# EasyEDA Pro project 单向户外电源_明月班.epro, schematic Schematic1
Board Name: 预驱; Create Date: 2025-08-27; Page Name: P1; Project Name: 单向户外电源; Schematic Name: Schematic1; Update Date: 2025-09-22; Company: 嘉立创EDA; Page Size: A4; Version: V1.0
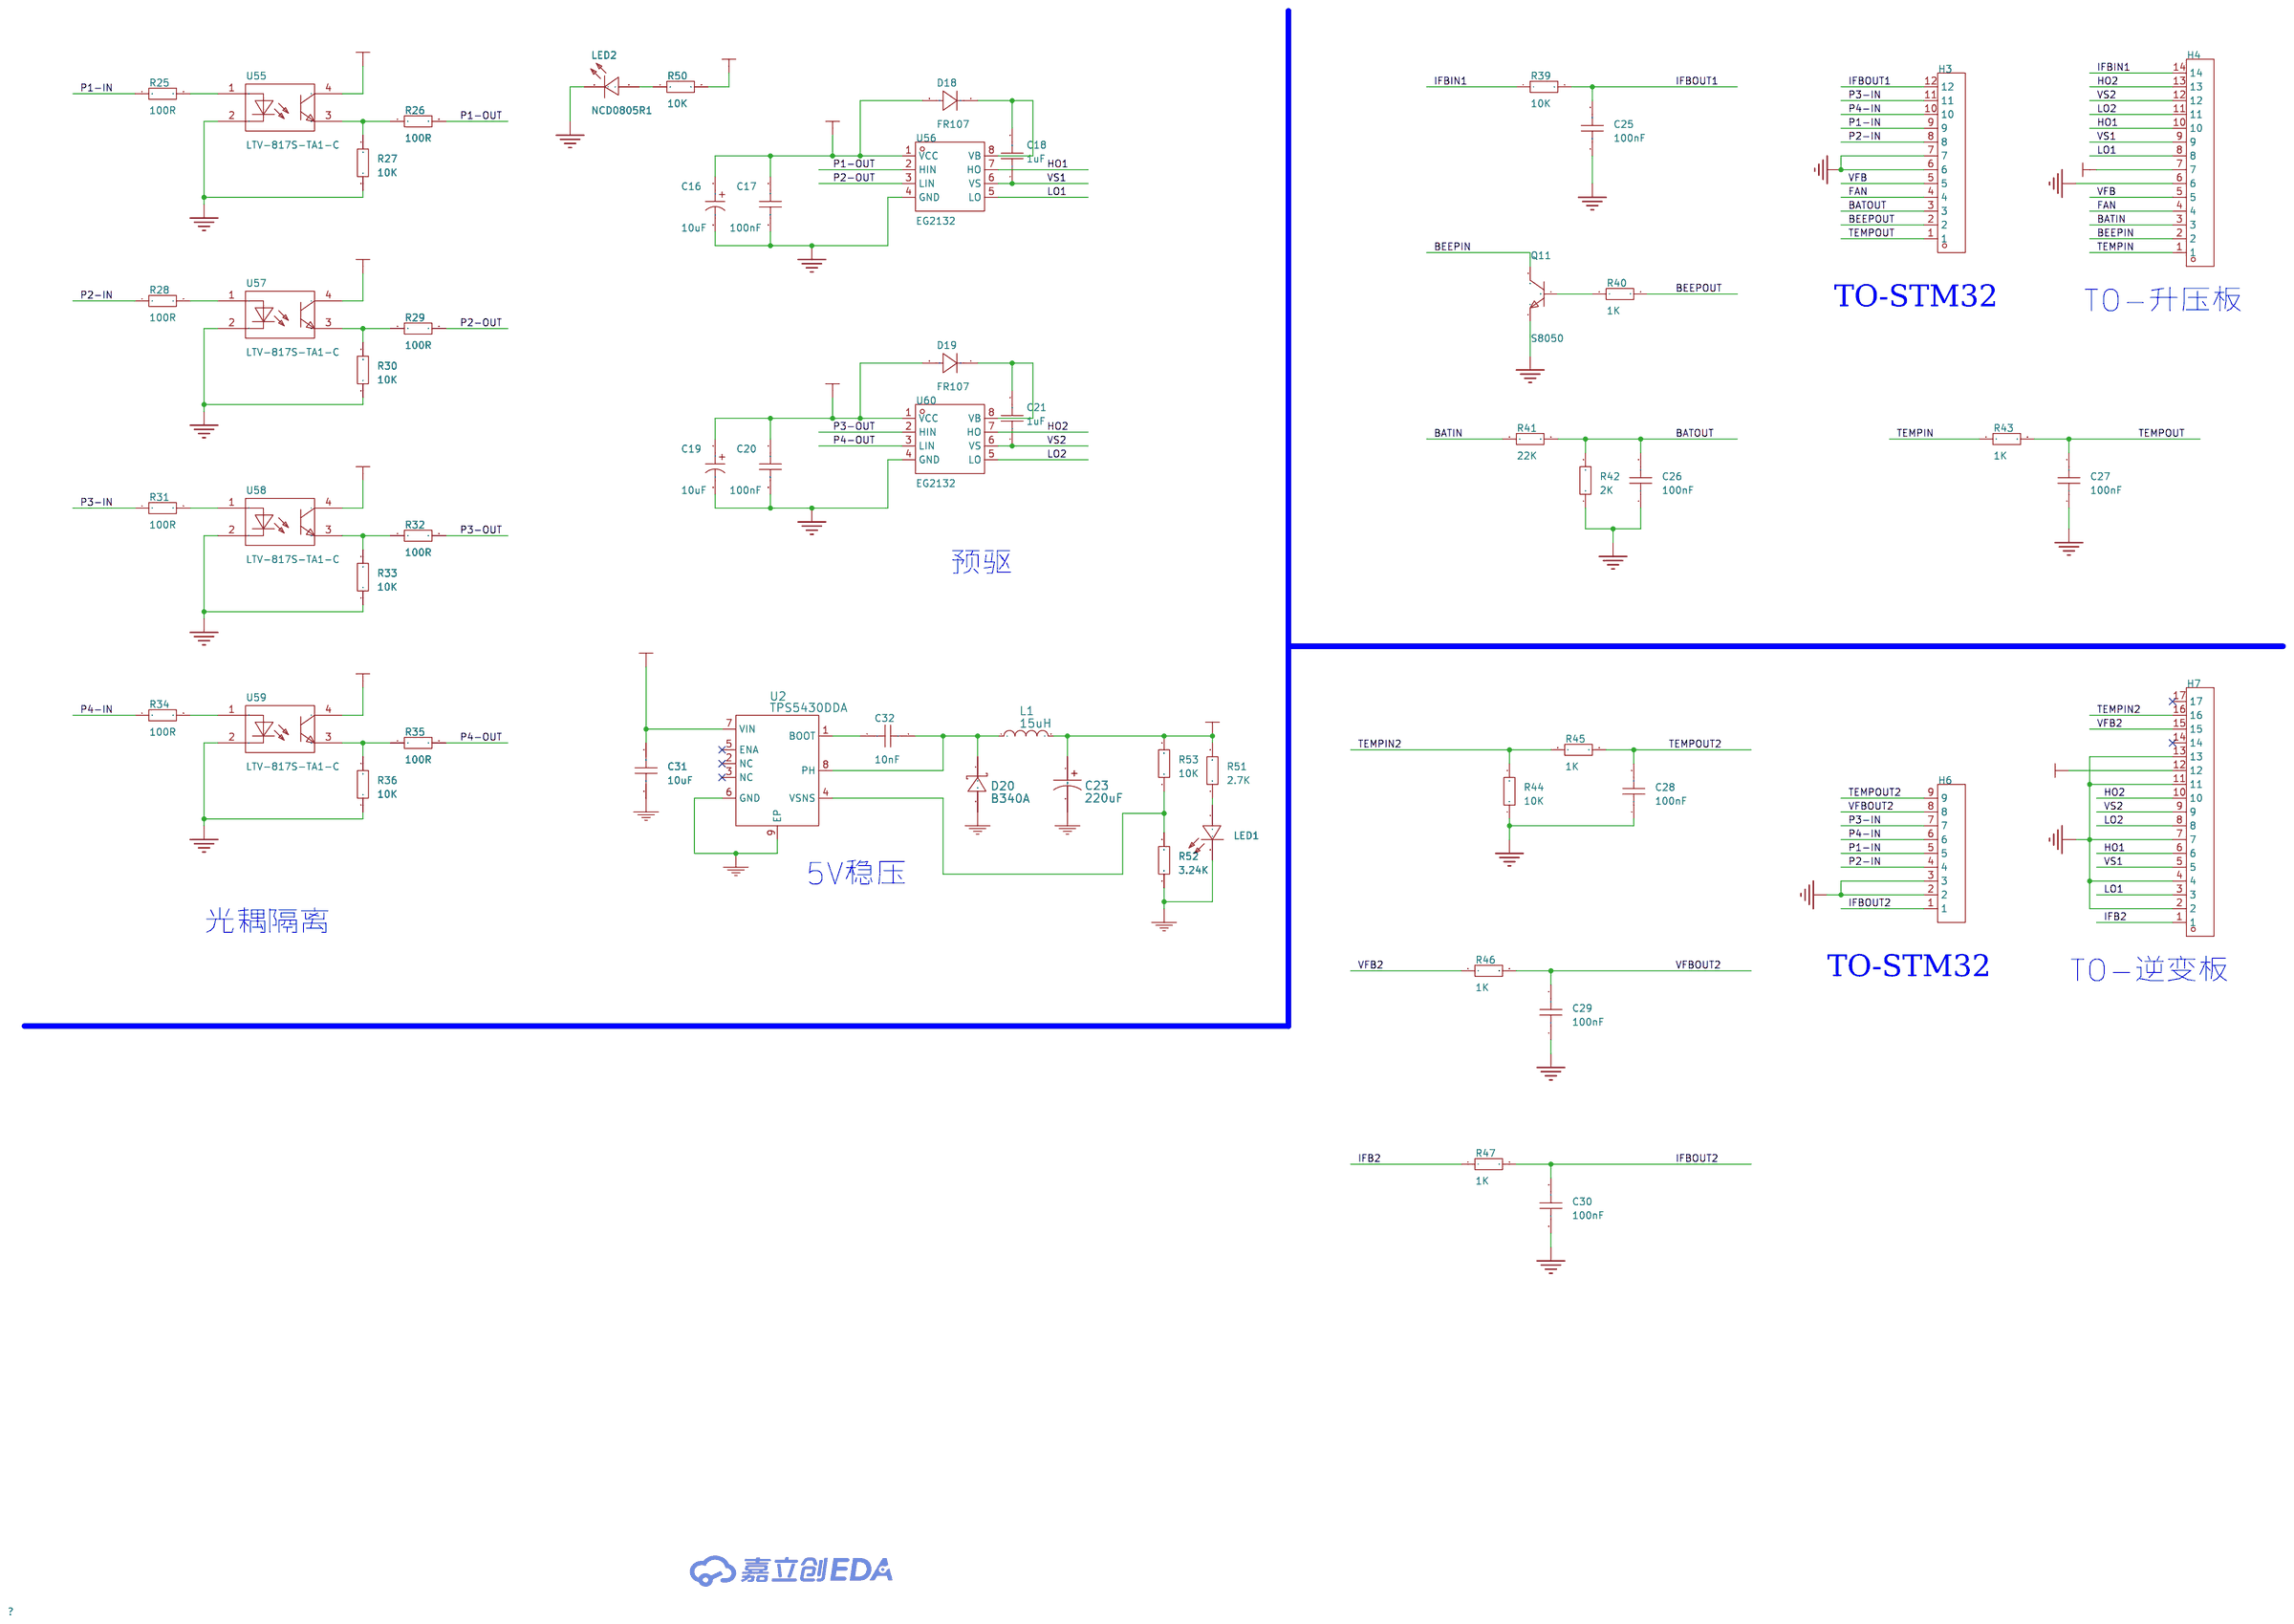
[diagram p0: schematic sheet]

## Parts
C16  10uF  [CAP-SMD_BD4.0-L4.3-W4.3-LS5.1-FD]
C17  100nF  [C0805]
C18  1uF  [C0805]
C19  10uF  [CAP-SMD_BD4.0-L4.3-W4.3-LS5.1-FD]
C20  100nF  [C0805]
C21  1uF  [C0805]
C23  220uF  [CAP-D6.3×F2.5]
C25  100nF  [C0805]
C26  100nF  [C0805]
C27  100nF  [C0805]
C28  100nF  [C0805]
C29  100nF  [C0805]
C30  100nF  [C0805]
C31  10uF  [C0805]
C32  10nF  [C0805]
D18  FR107  [SMA_L4.2-W2.7-LS5.3-RD]
D19  FR107  [SMA_L4.2-W2.7-LS5.3-RD]
D20  B340A  [SMA_L4.3-W2.6-LS5.1-RD]
H3  -  [HDR-TH_12P-P2.54-V-M]
H4  -  [HDR-TH_14P-P2.54-V-M]
H6  -  [HDR-TH_9P-P2.54-V-M]
H7  -  [HDR-TH_17P-P2.54-V-M]
L1  15uH  [IND-SMD_L7.5-W6.6]
LED1  NCD0805R1  [LED0805-R-RD]
LED2  NCD0805R1  [LED0805-R-RD]
Q11  S8050  [SOT-23-3_L2.9-W1.3-P1.90-LS2.3-BR]
R25  100R  [R0805]
R26  100R  [R0805]
R27  10K  [R0805]
R28  100R  [R0805]
R29  100R  [R0805]
R30  10K  [R0805]
R31  100R  [R0805]
R32  100R  [R0805]
R33  10K  [R0805]
R34  100R  [R0805]
R35  100R  [R0805]
R36  10K  [R0805]
R39  10K  [R0805]
R40  1K  [R0805]
R41  22K  [R0805]
R42  2K  [R0805]
R43  1K  [R0805]
R44  10K  [R0805]
R45  1K  [R0805]
R46  1K  [R0805]
R47  1K  [R0805]
R50  10K  [R0805]
R51  2.7K  [R0805]
R52  3.24K  [R0805]
R53  10K  [R0805]
U2  TPS5430DDA  [ESOP-8_L4.9-W3.9-P1.27-LS6.0-BL-EP-2]
U55  LTV-817S-TA1-C  [OPTO-SMD-4_L4.6-W6.5-P2.54-LS10.3-BL]
U56  EG2132  [SOP-8_L4.9-W3.9-P1.27-LS6.0-BL]
U57  LTV-817S-TA1-C  [OPTO-SMD-4_L4.6-W6.5-P2.54-LS10.3-BL]
U58  LTV-817S-TA1-C  [OPTO-SMD-4_L4.6-W6.5-P2.54-LS10.3-BL]
U59  LTV-817S-TA1-C  [OPTO-SMD-4_L4.6-W6.5-P2.54-LS10.3-BL]
U60  EG2132  [SOP-8_L4.9-W3.9-P1.27-LS6.0-BL]

## Library data of the parts
C16 C19 = JVJ25V10M4x6: 容值:10uF;精度:±20%;额定电压:25V;纹波电流:14mA@120Hz;; LCSC Part Name: 10uF ±20% 25V; Supplier Part: C46550403; Manufacturer: 捷而瑞; Supplier Footprint: SMD,D4xL5.7mm; JLCPCB Part Class: 扩展库; Datasheet: https://item.szlcsc.com/datasheet/JVJ25V10M4x6/48680097.html; Supplier: LCSC; Tolerance: ±20%; Voltage Rating: 25V; Ripple Current: 14mA@120Hz; Diameter: 0.2mm; Height - Seated (Max): 5.7mm; Lifetime: 2000hrs@105℃; Operating Temperature: -55℃~+105℃
C17 C18 C20 C21 C25-C32 = CAP_0805: Supplier Footprint: 0805
C23 = 220uF
D18 D19 = FR107_C2892324: 二极管配置:1个独立式;正向压降(Vf):1.3V@1A;直流反向耐压(Vr):1kV;整流电流:1A;反向恢复时间(Trr):500ns;; Supplier Part: C2892324; Manufacturer: YONGYUTAI(永裕泰); Supplier Footprint: SMA; JLCPCB Part Class: 扩展库; Datasheet: https://item.szlcsc.com/datasheet/FR107/3124344.html; Supplier: LCSC; Diode Configuration: 1个独立式; Voltage - Forward(Vf@If): 1.3V@1A; Voltage - DC Reverse(Vr): 1kV; Current - Rectified: 1A; Reverse Leakage Current (Ir): 5uA@1kV; Reverse Recovery Time (trr): 500ns; Operating Junction Temperature Range: -55℃~+150℃; Non-Repetitive Peak Forward Surge Current: 30A
D20 = B340A: Supplier: LCSC; Manufacturer: MDD; Supplier Part: C64982; JLCPCB Part Class: ExtendedPart
H3 = HDR-M_2.54_1x12P: 间距:2.54mm;总PIN位数:12;排数:1;插针结构:1x12P;行距:-;安装类型:直插;圆针/方针:方针;额定电流:3A;额定电压:250V;配合针长度:6mm;塑高:2.5mm;端接针长度:3mm;触头材质:-;工作温度范围:-40℃~+105℃;颜色:黑色;; Supplier Part: C2840012; Supplier Footprint: 插件
H4 = HDR-M_2.54_1x14P: 间距:2.54mm;总PIN位数:14;排数:1;插针结构:1x14P;行距:-;安装类型:直插;圆针/方针:方针;额定电流:3A;额定电压:-;配合针长度:6mm;塑高:2.5mm;端接针长度:3mm;触头材质:-;工作温度范围:-40℃~+105℃;颜色:黑色;; Supplier Part: C2894937; Supplier Footprint: 插件
H6 = HDR-M_2.54-1x9P: Supplier Part: C492408; Supplier Footprint: 插件
H7 = HDR-M_2.54_1x17P: 间距:2.54mm;总PIN位数:17;排数:1;插针结构:1x17P;行距:-;安装类型:直插;圆针/方针:方针;额定电流:3A;额定电压:-;配合针长度:6mm;塑高:2.5mm;端接针长度:3mm;触头材质:-;工作温度范围:-40℃~+105℃;颜色:黑色;; Supplier Part: C2894940; Supplier Footprint: 插件
L1 = CKST0605-15uH/M: Supplier: LCSC; Supplier Part: C3002651; Manufacturer: CENKER(岑科); JLCPCB Part Class: ExtendedPart
LED1 LED2 = NCD0805R1: 灯头类型:-;发光颜色:红色;正向电压(VF):1.6V~2.6V;功率:65mW;正向电流:20mA;主波长:615nm~630nm;二极管配置:独立二极管;透镜颜色:无色透明透镜;色温:-;发光强度:67mcd~195mcd;发光角度:130°;载带方式:-;工作温度:-30℃~+85℃;; Supplier Part: C84256; Manufacturer: 国星光电; Supplier Footprint: 0805; JLCPCB Part Class: 基础库; Datasheet: https://atta.szlcsc.com/upload/public/pdf/source/20200820/C84256_F0A75A43B3EAD75808600A0514C76B99.pdf; Supplier: LCSC; Emitted Color: 红色; Forward Voltage (VF): 1.6V~2.6V; Power Dissipation: 65mW; Forward Current: 20mA; Dominant Wavelength: 615nm~630nm; Diode Configuration: 独立二极管; Lens Color: 无色透明透镜; Luminous Intensity: 67mcd~195mcd; Viewing Angle: 130°; Operating Temperature: -30℃~+85℃
Q11 = S8050_C20069125: 晶体管类型:NPN;集电极电流(Ic):500mA;集射极击穿电压(Vceo):25V;耗散功率(Pd):300mW;直流电流增益(hFE):120@50mA,1.0V;; LCSC Part Name: hFE:200-350，丝印:J3Y S8050; Supplier Part: C20069125; Manufacturer: 宏嘉诚; Supplier Footprint: SOT-23; JLCPCB Part Class: 扩展库; Datasheet: https://atta.szlcsc.com/upload/public/pdf/source/20250624/73EDA2AB79795B2EF6617BE5A1B52BD3.pdf; Supplier: LCSC; type: NPN; Current - Collector(Ic): 500mA; Collector - Emitter Voltage VCEO: 25V; Pd - Power Dissipation: 300mW; DC Current Gain: 120@50mA,1.0V; Transition frequency(fT): 100MHz; Current - Collector Cutoff: 100nA; Vce Saturation(VCE(sat)): 600mV@500mA,50mA; Operating Temperature: -55℃~+150℃; Emitter-Base Voltage(Vebo): 5V
R25-R36 R39-R47 R50-R53 = Res_0805: Supplier Footprint: 0805
U2 = TPS5430DDA: Supplier: LCSC; Supplier Part: C502477; Manufacturer: TI(德州仪器); JLCPCB Part Class: ExtendedPart
U55 U57-U59 = LTV-817S-TA1-C: 输入电压类型:DC;正向压降(Vf):1.2V;输出电流:50mA;隔离电压(Vrms):5kV;直流反向耐压(Vr):6V;负载电压:35V;输出通道数:1;集射极饱和电压(VCE(sat)):100mV@1mA,20mA;; LCSC Part Name: DC输入 隔离电压(rms):5000V; Supplier Part: C109227; Manufacturer: LITEON(光宝); Supplier Footprint: SMD-4P; JLCPCB Part Class: 基础库; Datasheet: https://item.szlcsc.com/datasheet/LTV-817S-TA1-C/110448.html; Supplier: LCSC; Input voltage type: DC; Output Type: 光电三极管; Voltage - Forward(Vf): 1.2V; Output Current: 50mA; Isolation Voltage(Vrms): 5kV; Reverse Voltage: 6V; Load Voltage: 35V; Number of Outputs: 1; Vce Saturation(VCE(sat)): 100mV@1mA,20mA; Rise time: 4us@2mA,100Ω; Fall time: 3us@2mA,100Ω; Operating Temperature: -30℃~+110℃
U56 U60 = EG2132: 负载类型:MOSFET；IGBT;工作电压:8V~20V;下降时间(tf):70ns;; LCSC Part Name: 大功率MOS管、IGBT管栅极驱动芯片; Supplier Part: C480660; Manufacturer: EG(屹晶微); Supplier Footprint: SOP-8; JLCPCB Part Class: 扩展库; Datasheet: https://item.szlcsc.com/datasheet/EG2132/488583.html; Supplier: LCSC; Load Type: MOSFET；IGBT; Voltage - Supply: 8V~20V; Fall Time: 70ns; Operating Temperature: -45℃~+125℃

## Nets
5V: C23.1 L1.2 R51.2 R53.2 U55.4 U57.4 U58.4 U59.4
12V: C16.1 C17.1 C19.1 C20.1 C31.2 D18.2(A) D19.2(A) H4.7 H7.12 R50.2 U2.7(VIN) U56.1(VCC) U60.1(VCC)
GND: C16.2 C17.2 C19.2 C20.2 C23.2 C25.1 C26.1 C27.1 C28.1 C29.1 C30.1 C31.1 D20.2(A) H3.6 H3.7 H4.6 H6.2 H6.3 H7.2 H7.4 H7.7 H7.11 H7.13 LED1.2(-) LED2.2(-) Q11.2(E) R27.1 R30.1 R33.1 R36.1 R42.1 R44.1 R52.1 U2.6(GND) U2.9(EP) U55.2 U56.4(GND) U57.2 U58.2 U59.2 U60.4(GND)
BATIN: H4.3 R41.1
BATOUT: C26.2 H3.3 R41.2 R42.2
BEEPIN: H4.2 Q11.3(C)
BEEPOUT: H3.2 R40.2
FAN: H3.4 H4.4
HO1: H4.10 H7.6 U56.7(HO)
HO2: H4.13 H7.10 U60.7(HO)
IFB2: H7.1 R47.1
IFBIN1: H4.14 R39.1
IFBOUT1: C25.2 H3.12 R39.2
IFBOUT2: C30.2 H6.1 R47.2
LO1: H4.8 H7.3 U56.5(LO)
LO2: H4.11 H7.8 U60.5(LO)
P1-IN: H3.9 H6.5 R25.1
P1-OUT: R26.2 U56.2(HIN)
P2-IN: H3.8 H6.4 R28.1
P2-OUT: R29.2 U56.3(LIN)
P3-IN: H3.11 H6.7 R31.1
P3-OUT: R32.2 U60.2(HIN)
P4-IN: H3.10 H6.6 R34.1
P4-OUT: R35.2 U60.3(LIN)
TEMPIN: H4.1 R43.1
TEMPIN2: H7.16 R44.2 R45.2
TEMPOUT: C27.2 H3.1 R43.2
TEMPOUT2: C28.2 H6.9 R45.1
VFB: H3.5 H4.5
VFB2: H7.15 R46.1
VFBOUT2: C29.2 H6.8 R46.2
VS1: C18.1 H4.9 H7.5 U56.6(VS)
VS2: C21.1 H4.12 H7.9 U60.6(VS)
$1N2145: R25.2 U55.1
$1N2151: R26.1 R27.2 U55.3
$1N2169: C18.2 D18.1(K) U56.8(VB)
$1N2174: R28.2 U57.1
$1N2180: R29.1 R30.2 U57.3
$1N2184: R31.2 U58.1
$1N2190: R32.1 R33.2 U58.3
$1N2194: R34.2 U59.1
$1N2200: R35.1 R36.2 U59.3
$1N2218: C21.2 D19.1(K) U60.8(VB)
$1N2226: C32.1 U2.1(BOOT)
$1N2227: C32.2 D20.1(K) L1.1 U2.8(PH)
$1N2251: Q11.1(B) R40.1
$1N2628: LED1.1(+) R51.1
$1N2716: LED2.1(+) R50.1
$1N4175: R52.2 R53.1 U2.4(VSNS)

Not connected (* = marked no-connect by the designer): H7 14* 17*; U2 2(NC)* 3(NC)* 5(ENA)*

## Notes on the sheet
- TO-STM32
- TO-升压板
- 预驱
- 5V稳压
- 光耦隔离
- TO-STM32
- TO-逆变板
